# Altium project Flasher_V2.PrjPcb
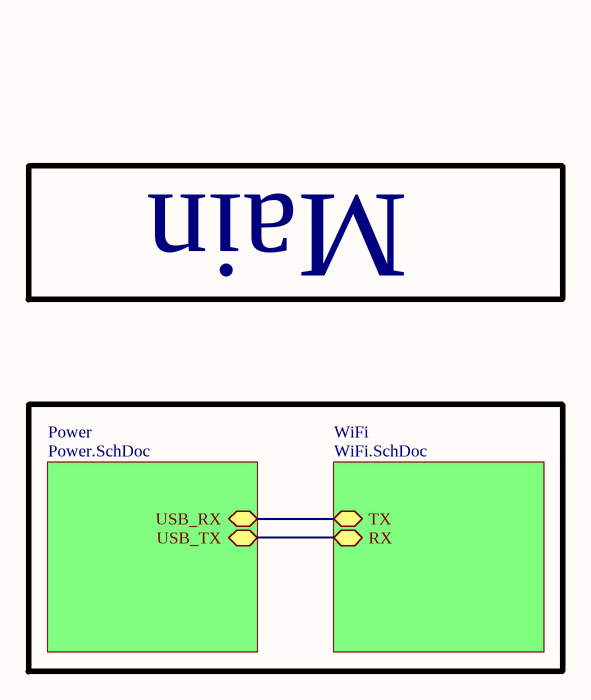
[diagram p0: Main.SchDoc]
3 sheets, 12 parts. Net scope: hierarchical (ports join the sheet entries above them; power ports are global).
Board file: Flasher_V2.PcbDoc
Sheets:
  Main.SchDoc
    Power = Power.SchDoc
    WiFi = WiFi.SchDoc

## Sheet Main.SchDoc: IoTBoard
size A; Author: Samson March; DrawnBy: Samson March; DocumentNumber: 1; Revision: 2; SheetNumber: 1; SheetTotal: 6; DocumentName: IoTBoard; ProjectName: IoTBoard

### Sub-sheets
Power = Power.SchDoc: USB_TX, USB_RX
WiFi = WiFi.SchDoc: RX, TX

### Nets
RX: sheet Power/USB_TX, sheet WiFi/RX
TX: sheet Power/USB_RX, sheet WiFi/TX

### Notes on the sheet
- Main

## Sheet Power.SchDoc
size A
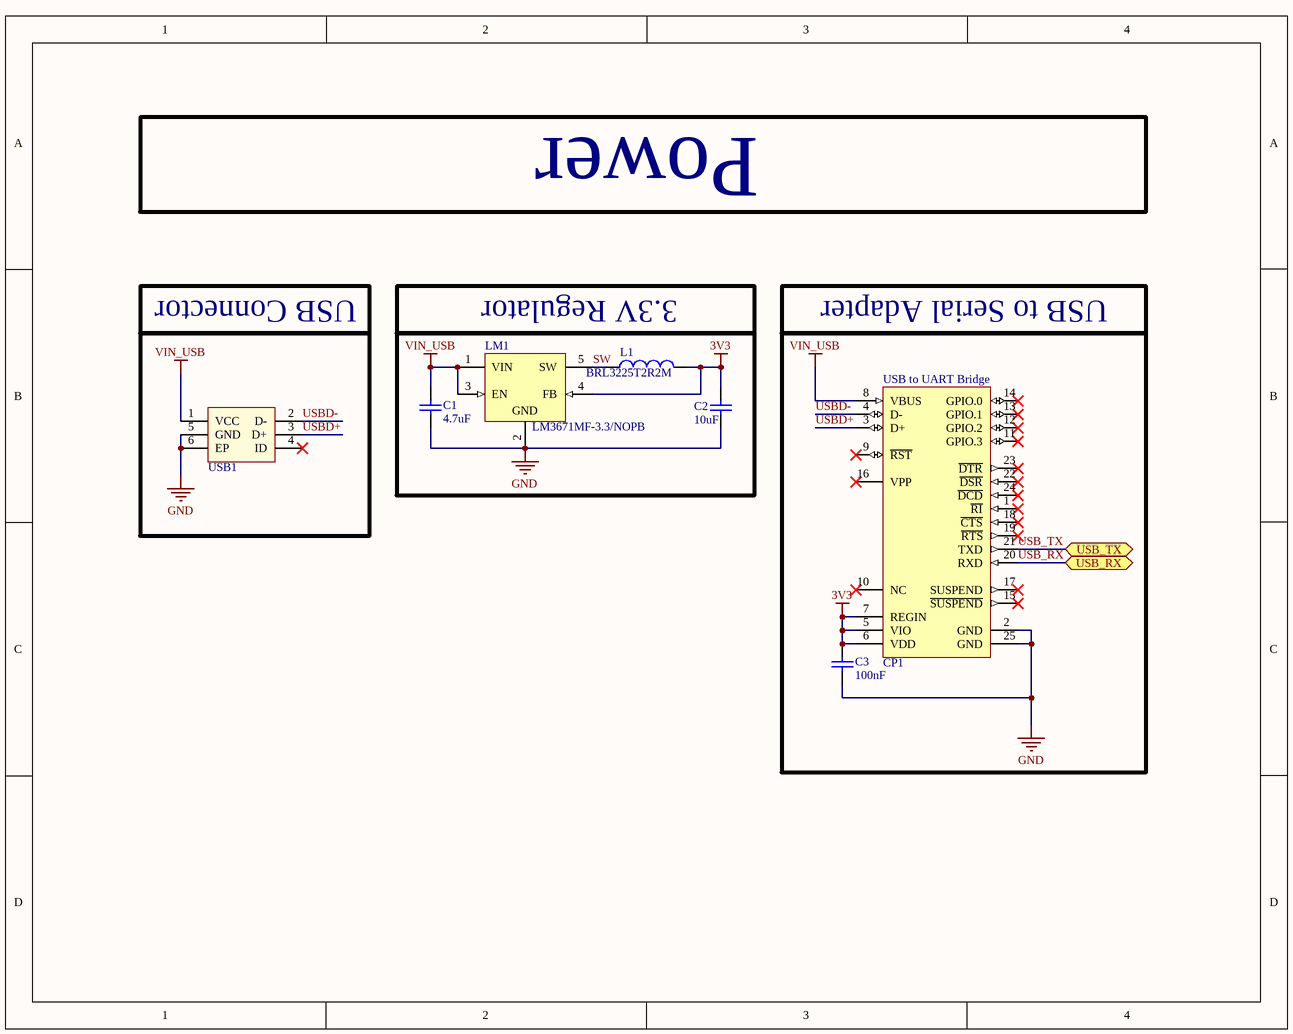
[diagram p1: Power.SchDoc]

### Parts
C1  4.7uF  [CAPC0805(2012)145_L]
C2  10uF  [CAPC0805(2012)100_L]
C3  100nF  [CAPC0805(2012)100_L]
CP1  USB to UART Bridge  [PCBComponent]
L1  BRL3225T2R2M  [C1210_L]
LM1  LM3671MF-3.3/NOPB  [DBV0005A_N]
USB1  USB3100-30-A Flipped USB  [PCBComponent]  (value not drawn)

### Ports
USB_RX, USB_TX

### Nets
3V3: C2.2 C3.2 CP1.5(VIO) CP1.6(VDD) CP1.7(REGIN) L1.2 LM1.4(FB)
GND: C1.1 C2.1 C3.1 CP1.2(GND) CP1.25(GND) LM1.2(GND) USB1.5(GND) USB1.6(EP)
VIN_USB: C1.2 CP1.8(VBUS) LM1.1(VIN) LM1.3(EN) USB1.1(VCC)
SW: L1.1 LM1.5(SW)
USB_RX: CP1.20(RXD) ; port USB_RX  [project net TX]
USB_TX: CP1.21(TXD) ; port USB_TX  [project net RX]
USBD+: CP1.3(D+) USB1.3(D+)
USBD-: CP1.4(D-) USB1.2(D-)

Not connected (* = marked no-connect by the designer): CP1 1(~{RI})* 9(~{RST})* 10(NC)* 11(GPIO.3)* 12(GPIO.2)* 13(GPIO.1)* 14(GPIO.0)* 15(~{SUSPEND})* 16(VPP)* 17(SUSPEND)* 18(~{CTS})* 19(~{RTS})* 22(~{DSR})* 23(~{DTR})* 24(~{DCD})*; USB1 4(ID)*

### Notes on the sheet
- Power
- USB Connector
- 3.3V Regulator
- USB to Serial Adapter

### Library data of the parts
C1 = CMP-1036-04884-1: CAP 4.7uF 10V ±20% 0805 (2012 Metric) Thickness 1.45mm SMD; Case-EIA: 0805; Case-Metric: 2012; Tolerance: Â±20%; Rated Voltage: 10 V; Value: 4.7uF; Technology: SMT; Max Thickness: 1.45 mm
C2 = CMP-1036-04925-1: CAP 10uF 10V ±20% 0805 (2012 Metric) Thickness 1mm SMD; Case-Metric: 2012; Case-EIA: 0805; Tolerance: Â±20%; Technology: SMT; Max Thickness: 1 mm; Rated Voltage: 10 V; Value: 10uF
C3 = CMP-1036-04394-1: CAP 100nF 10V ±10% 0805 (2012 Metric) Thickness 1mm SMD; Case-EIA: 0805; Tolerance: Â±10%; Case-Metric: 2012; Max Thickness: 1 mm; Technology: SMT; Value: 100nF; Rated Voltage: 10 V
CP1 = CP2104-A.2
L1 = IND-BRL3225T2R2M-2: INDUCTOR 2.2UH 1.85A 20% 1210 SM; Manufacturer: Taiyo Yuden; Type: Wirewound; Inductance: 2.2µH; Current Rating: 1.6A; Shielding: Unshielded; DC Resistance (DCR): 78 mOhm Max; Frequency - Self Resonant: 150MHz; Frequency - Test: 100kHz; Packaging: Digi-Reel®; Material - Core: -; Tolerance: ±20%; Current - Saturation: 1.85A; Q @ Freq: -; Operating Temperature: -40°C ~ 105°C; Mounting Type: Surface Mount; Package / Case: 1210 (3225 Metric); Size / Dimension: 0.126" L x 0.100" W (3.20mm x 2.50mm); Height - Seated (Max): 0.067" (1.70mm); Supplier Device Package: 1210; ComponentLink1URL: http://www.yuden.co.jp/ut/product/category/inductor/BRL3225T2R2M.pdf; ComponentLink1Description: http://www.yuden.co.jp/ut/product/category/inductor/BRL3225T2R2M.pdf; Supplier 1: Digi-Key; Supplier Part Number 1: 587-2165-6-ND; Manufacturer Part Number: BRL3225T2R2M; RoHS: RoHS Compliant; Category: Inductors, Coils, Chokes; Stock 1: 10520; Pricing 1: 1=0.21, 10=0.196, 50=0.1838, 100=0.1715, 500=0.13476, 1000=0.11025 (USD)
LM1 = CMP-0063-01132-3: 2MHz, 600mA Step-Down DC-DC Converter, 5-pin SOT-23, Pb-Free; Manufacturer: Texas Instruments; CompType: MiscPower; PowerWise: Y; PackageTopMarking: SJEB*XTT; PackageDescription: Molded SOT-23, .115 x .063 x .040 in Body, 5 Lead, .0375 in Pitch; ComponentLink1Description: Datasheet URL; PackageReference: DBV0005A; PinCount: 5; RoHS: Y; ComponentLink1URL: http://www.ti.com/general/docs/lit/getliterature.tsp?genericPartNumber=LM3671&fileType=pdf
USB1 = USB3100-30-A-A.1: Flipped USB Connector, Micro USB Type B, USB 2.0, Receptacle, 5 Positions, Surface Mount, Right Angle

## Sheet WiFi.SchDoc
size A
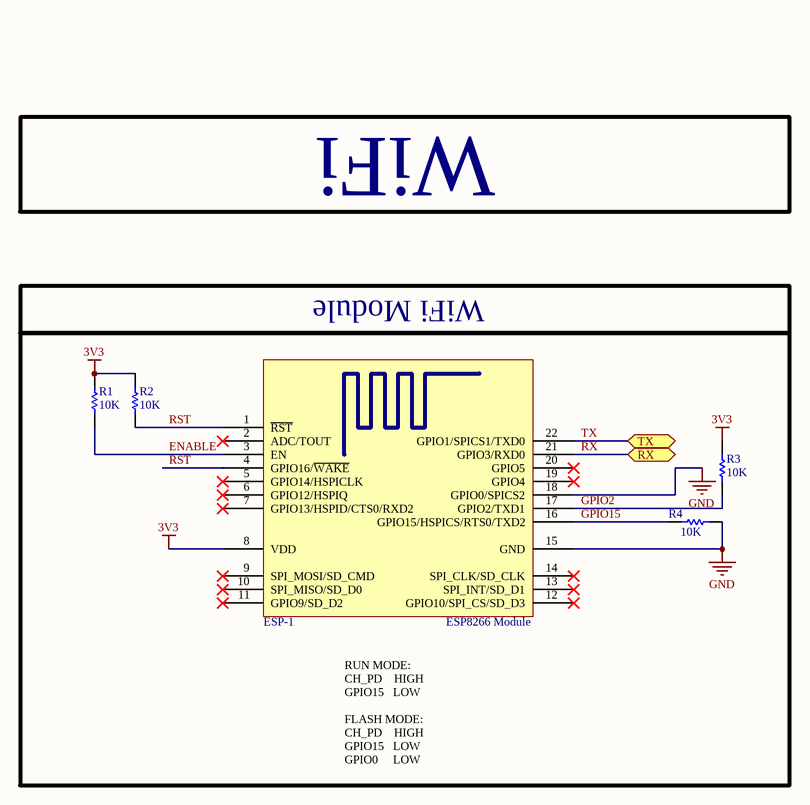
[diagram p2: WiFi.SchDoc]

### Parts
ESP-1  ESP8266 Module  [PCBComponent]
R1  10K  [RESC0805(2012)_L]
R2  10K  [RESC0805(2012)_L]
R3  10K  [RESC0805(2012)_L]
R4  10K  [RESC0805(2012)_L]

### Ports
RX, TX

### Nets
3V3: ESP-1.8(VDD) R1.2 R2.2 R3.2
GND: ESP-1.15(GND) ESP-1.18(GPIO0/SPICS2) R4.1
ENABLE: ESP-1.3(EN) R1.1
GPIO2: ESP-1.17(GPIO2/TXD1) R3.1
GPIO15: ESP-1.16(GPIO15/HSPICS/RTS0/TXD2) R4.2
RST: ESP-1.1(~{RST}) ESP-1.4(GPIO16/~{WAKE}) R2.1
RX: ESP-1.21(GPIO3/RXD0) ; port RX
TX: ESP-1.22(GPIO1/SPICS1/TXD0) ; port TX

Not connected (* = marked no-connect by the designer): ESP-1 2(ADC/TOUT)* 5(GPIO14/HSPICLK)* 6(GPIO12/HSPIQ)* 7(GPIO13/HSPID/CTS0/RXD2)* 9(SPI_MOSI/SD_CMD)* 10(SPI_MISO/SD_D0)* 11(GPIO9/SD_D2)* 12(GPIO10/SPI_CS/SD_D3)* 13(SPI_INT/SD_D1)* 14(SPI_CLK/SD_CLK)* 19(GPIO4)* 20(GPIO5)*

### Notes on the sheet
- WiFi
- WiFi Module
- (near ESP-1) RUN MODE:
  CH_PD    HIGH
  GPIO15   LOW
  FLASH MODE:
  CH_PD    HIGH
  GPIO15   LOW
  GPIO0     LOW

### Library data of the parts
ESP-1 = ESP-12E-A.4
R1-R4 = CMP-1013-00098-1: 10K 0.125W 5% 0805 (2012 Metric)  SMD; Case-EIA: 0805; Case-Metric: 2012; Value: 10000.00 Ohm; Power: 0.125 W; Technology: SMT; Tolerance: 5 %

## Nets that join several sheets
3V3: Power (7 pins), WiFi (ESP-1.8 R1.2 R2.2 R3.2)
GND: Power (8 pins), WiFi (ESP-1.15 ESP-1.18 R4.1)
RX: Power (CP1.21), WiFi (ESP-1.21)
TX: Power (CP1.20), WiFi (ESP-1.22)